# Altium schematic sheet MC_SunSensorPCB.SchDoc
size 594 x 420 mm
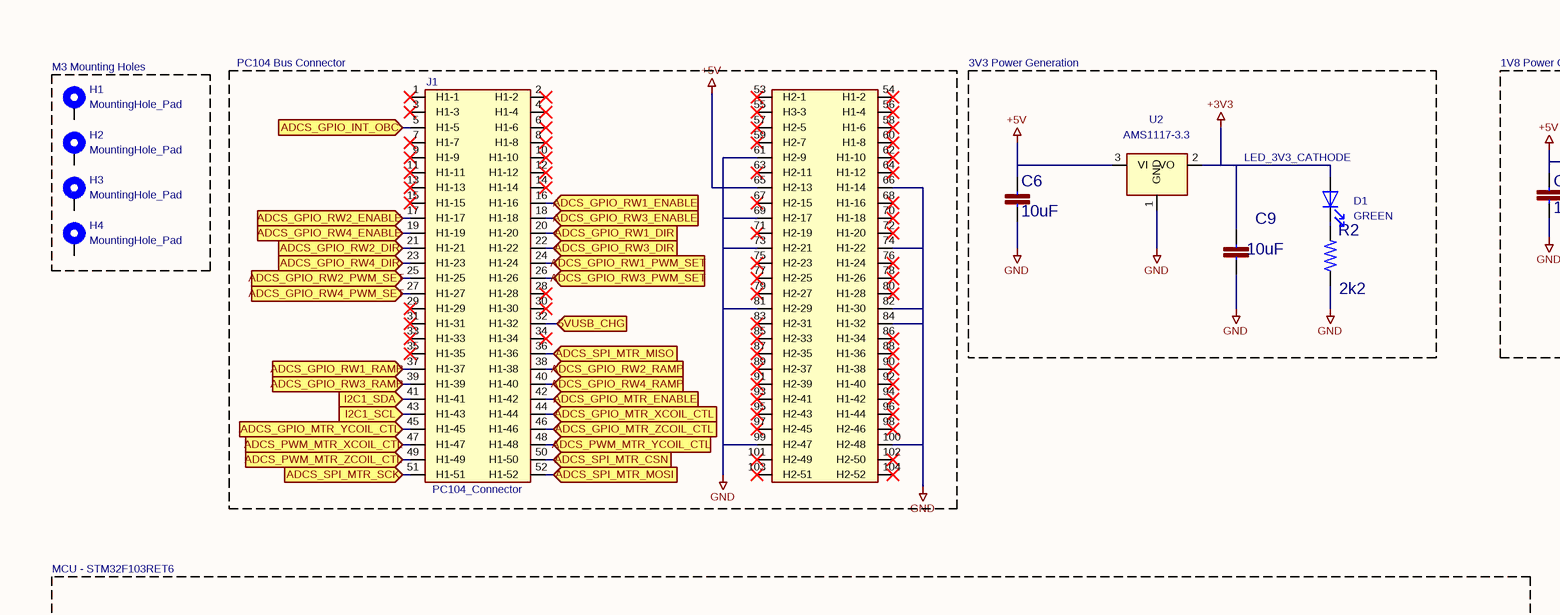
[diagram p0: MC_SunSensorPCB.SchDoc, top left]
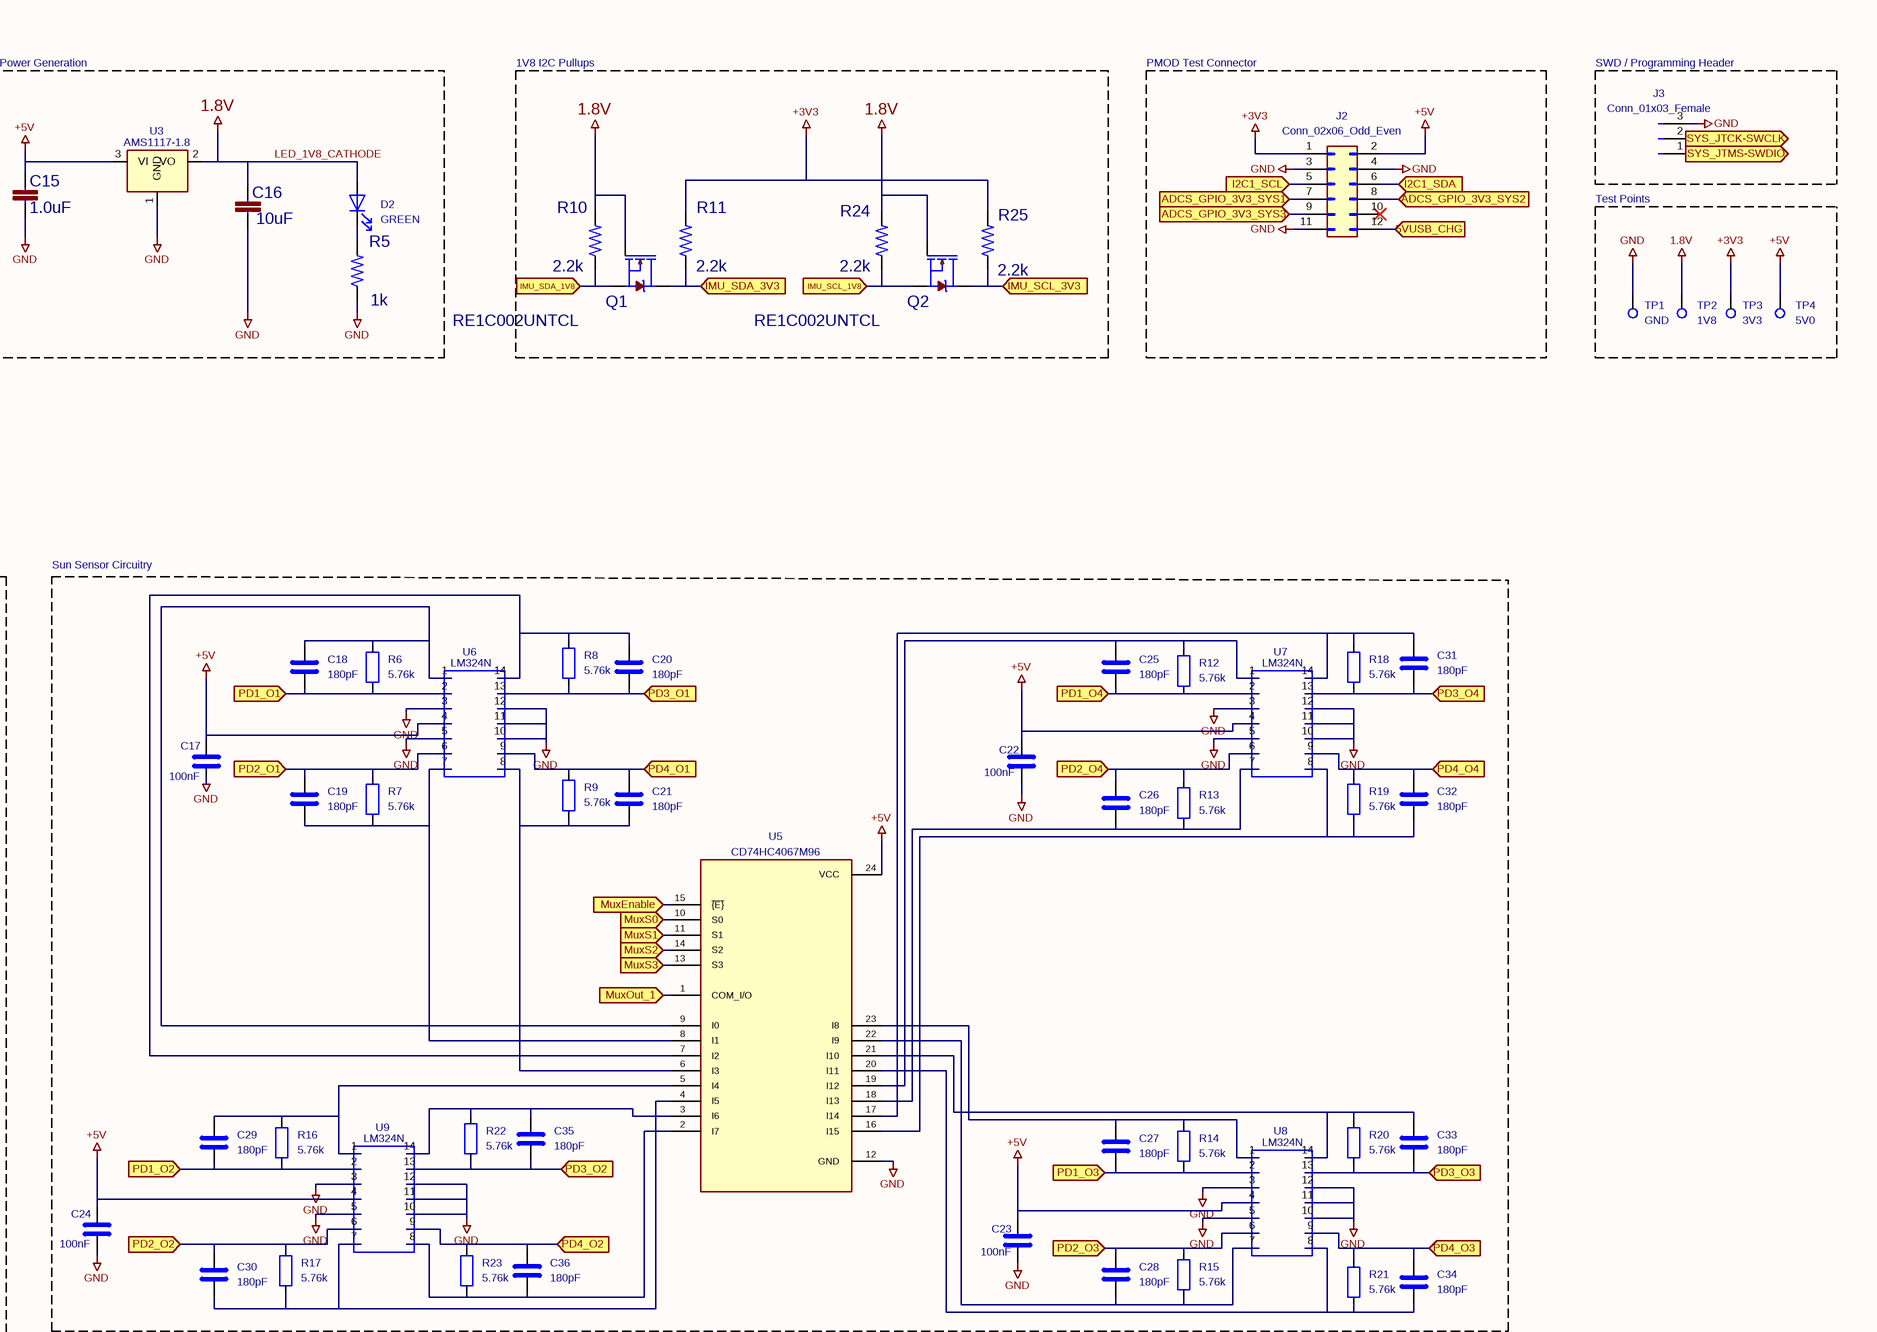
[diagram p1: MC_SunSensorPCB.SchDoc, top right]
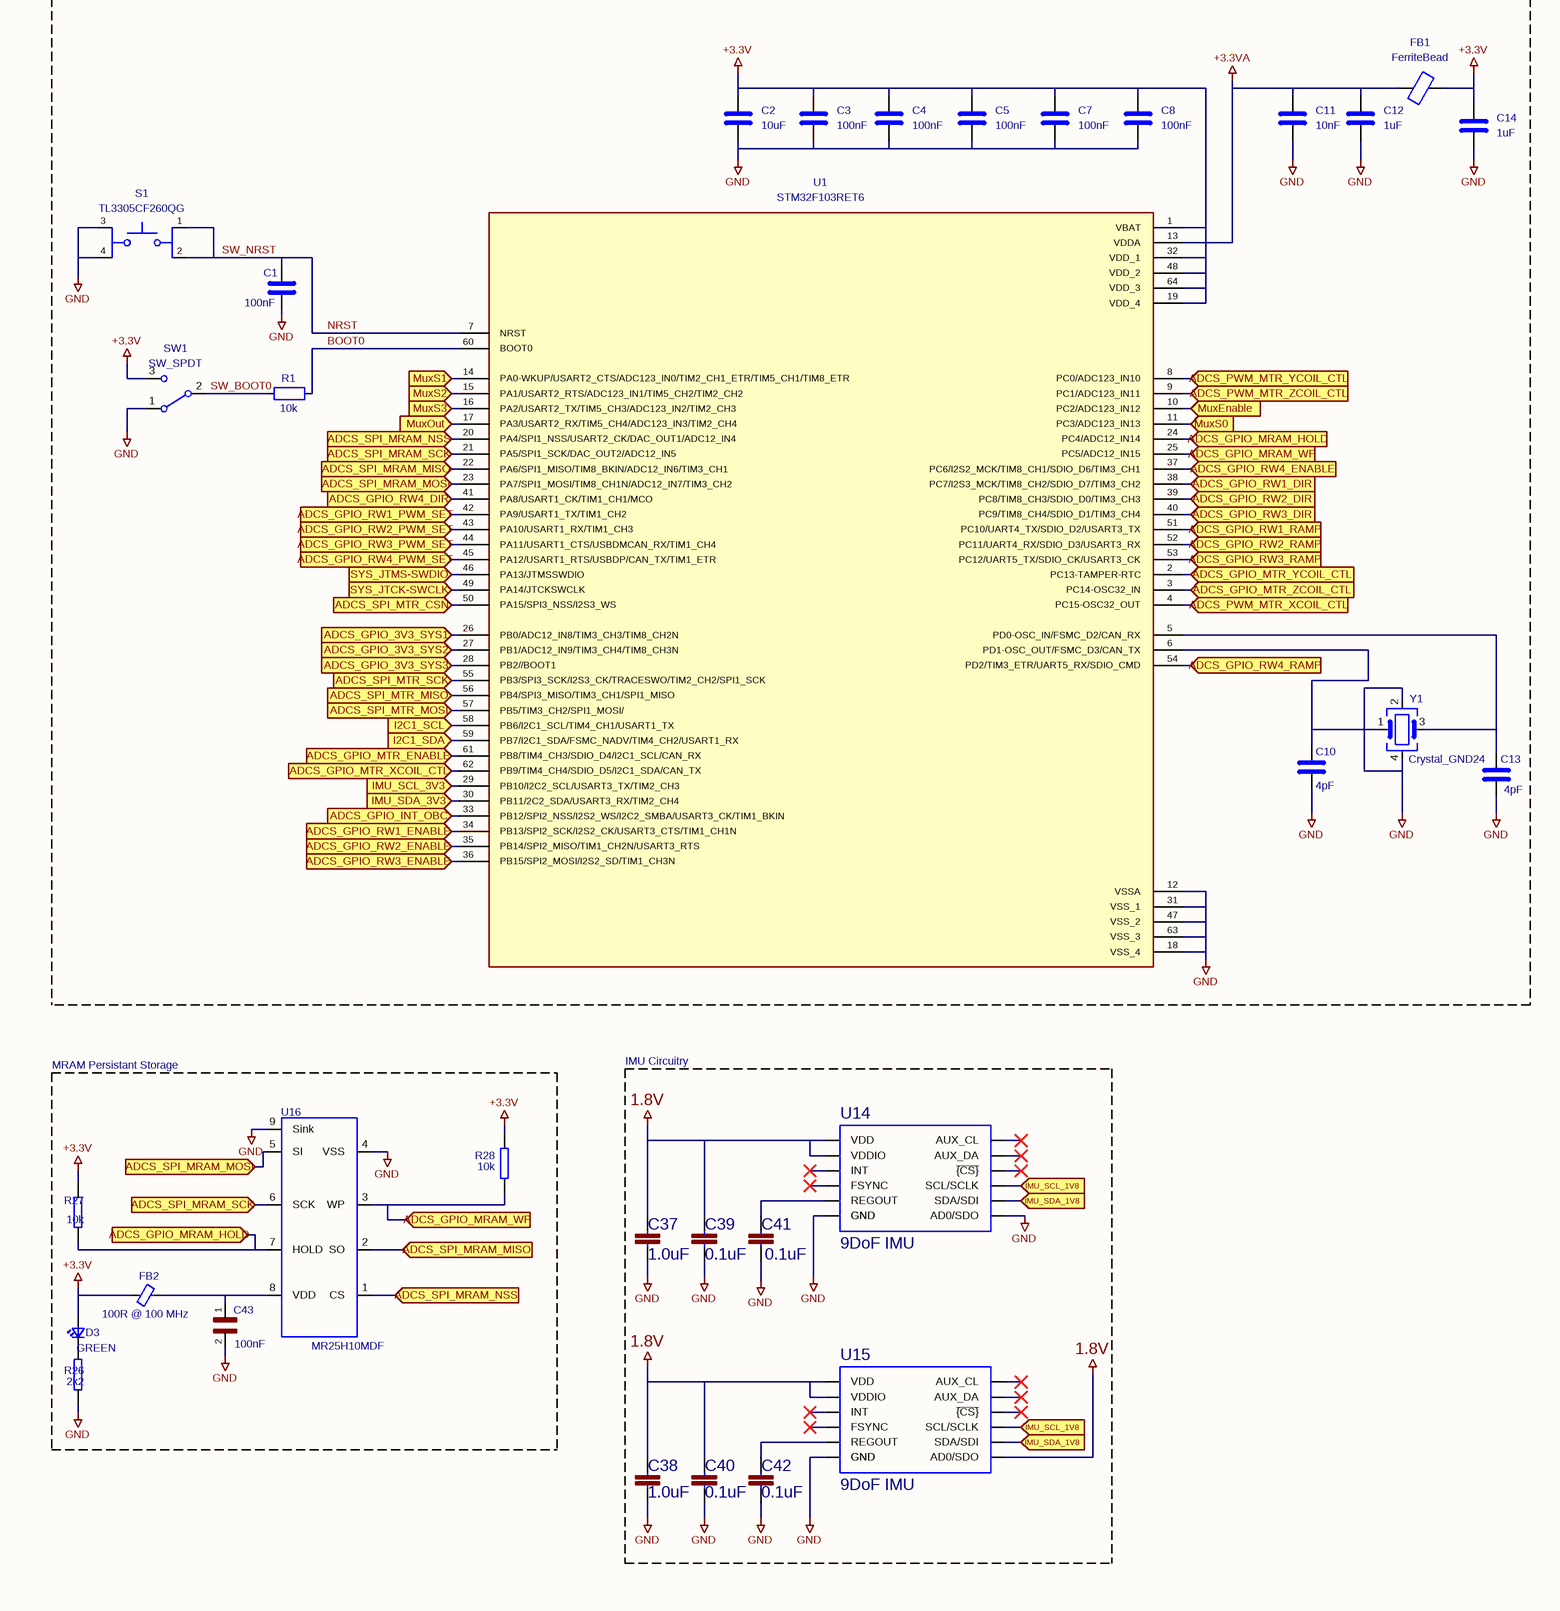
[diagram p2: MC_SunSensorPCB.SchDoc, bottom left]
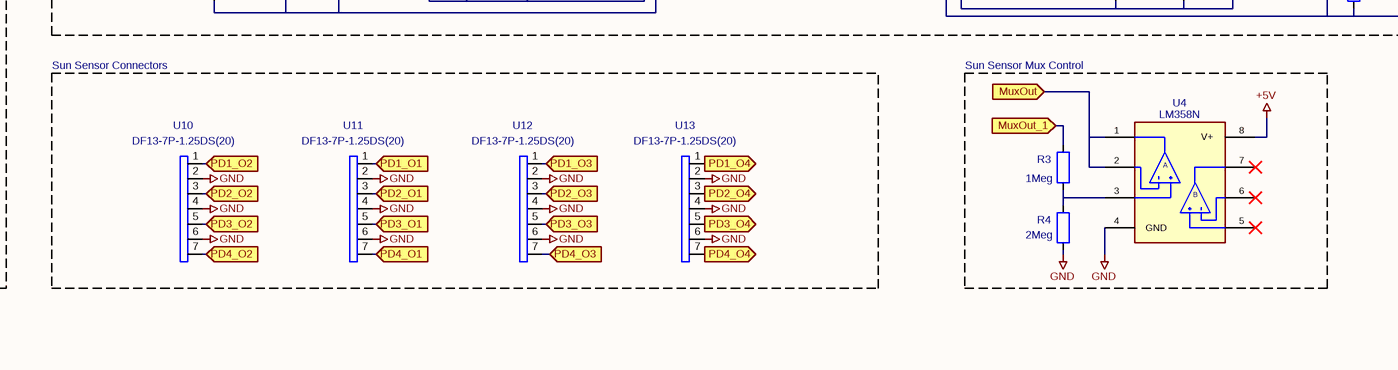
[diagram p3: MC_SunSensorPCB.SchDoc, bottom right]

## Parts
C1  100nF  [C_0603_1608Metric]
C2  10uF  [C_0603_1608Metric]
C3  100nF  [C_0402_1005Metric]
C4  100nF  [C_0402_1005Metric]
C5  100nF  [C_0402_1005Metric]
C6  10uF  [C_0603_1608Metric]
C7  100nF  [C_0402_1005Metric]
C8  100nF  [C_0402_1005Metric]
C9  10uF  [C_0603_1608Metric]
C10  4pF  [C_0402_1005Metric]
C11  10nF  [C_0402_1005Metric]
C12  1uF  [C_0603_1608Metric]
C13  4pF  [C_0402_1005Metric]
C14  1uF  [C_0603_1608Metric]
C15  1.0uF  [C_0603_1608Metric]
C16  10uF  [C_0603_1608Metric]
C17  100nF  [C_0603_1608Metric]
C18  180pF  [C_0603_1608Metric]
C19  180pF  [C_0603_1608Metric]
C20  180pF  [C_0603_1608Metric]
C21  180pF  [C_0603_1608Metric]
C22  100nF  [C_0603_1608Metric]
C23  100nF  [C_0603_1608Metric]
C24  100nF  [C_0603_1608Metric]
C25  180pF  [C_0603_1608Metric]
C26  180pF  [C_0603_1608Metric]
C27  180pF  [C_0603_1608Metric]
C28  180pF  [C_0603_1608Metric]
C29  180pF  [C_0603_1608Metric]
C30  180pF  [C_0603_1608Metric]
C31  180pF  [C_0603_1608Metric]
C32  180pF  [C_0603_1608Metric]
C33  180pF  [C_0603_1608Metric]
C34  180pF  [C_0603_1608Metric]
C35  180pF  [C_0603_1608Metric]
C36  180pF  [C_0603_1608Metric]
C37  1.0uF  [C_0603_1608Metric]
C38  1.0uF  [C_0603_1608Metric]
C39  0.1uF  [C_0603_1608Metric]
C40  0.1uF  [C_0603_1608Metric]
C41  0.1uF  [C_0603_1608Metric]
C42  0.1uF  [C_0603_1608Metric]
C43  100nF  [C_0603_1608Metric]
D1  GREEN  [LED_0603_1608Metric]
D2  GREEN  [LED_0603_1608Metric]
D3  GREEN  [LED_0603_1608Metric]
FB1  FerriteBead  [L_0603_1608Metric]
FB2  100R @ 100 MHz  [L_0603_1608Metric]
H1  MountingHole_Pad  [MountingHole_3.2mm_M3_Pad_TopBottom]
H2  MountingHole_Pad  [MountingHole_3.2mm_M3_Pad_TopBottom]
H3  MountingHole_Pad  [MountingHole_3.2mm_M3_Pad_TopBottom]
H4  MountingHole_Pad  [MountingHole_3.2mm_M3_Pad_TopBottom]
J1  PC104_Connector  [pc104-connector]
J2  Conn_02x06_Odd_Even  [PinSocket_2x06_P2.54mm_Horizontal]
J3  Conn_01x03_Female  [PinHeader_1x03_P2.54mm_Vertical]
Q1  RE1C002UNTCL  [RE1C002UNTCL]
Q2  RE1C002UNTCL  [RE1C002UNTCL]
R1  10k  [R_0603_1608Metric]
R2  2k2  [R_0603_1608Metric]
R3  1Meg  [R_0603_1608Metric]
R4  2Meg  [R_0603_1608Metric]
R5  1k  [R_0603_1608Metric]
R6  5.76k  [R_0603_1608Metric]
R7  5.76k  [R_0603_1608Metric]
R8  5.76k  [R_0603_1608Metric]
R9  5.76k  [R_0603_1608Metric]
R10  2.2k  [R_0603_1608Metric]
R11  2.2k  [R_0603_1608Metric]
R12  5.76k  [R_0603_1608Metric]
R13  5.76k  [R_0603_1608Metric]
R14  5.76k  [R_0603_1608Metric]
R15  5.76k  [R_0603_1608Metric]
R16  5.76k  [R_0603_1608Metric]
R17  5.76k  [R_0603_1608Metric]
R18  5.76k  [R_0603_1608Metric]
R19  5.76k  [R_0603_1608Metric]
R20  5.76k  [R_0603_1608Metric]
R21  5.76k  [R_0603_1608Metric]
R22  5.76k  [R_0603_1608Metric]
R23  5.76k  [R_0603_1608Metric]
R24  2.2k  [R_0603_1608Metric]
R25  2.2k  [R_0603_1608Metric]
R26  2k2  [R_0603_1608Metric]
R27  10k  [R_0402_1005Metric]
R28  10k  [R_0402_1005Metric]
S1  TL3305CF260QG  [SW_TL3305CF260QG]
SW1  SW_SPDT  [SW_SPDT_PCM12]
TP1  GND  [TestPoint_THTPad_2.0x2.0mm_Drill1.0mm]
TP2  1V8  [TestPoint_THTPad_2.0x2.0mm_Drill1.0mm]
TP3  3V3  [TestPoint_THTPad_2.0x2.0mm_Drill1.0mm]
TP4  5V0  [TestPoint_THTPad_2.0x2.0mm_Drill1.0mm]
U1  STM32F103RET6  [QFP50P1200X1200X160-64N]
U2  AMS1117-3.3  [SOT-223-3_TabPin2]
U3  AMS1117-1.8  [SOT-223-3_TabPin2]
U4  LM358N  [DIP794W45P254L959H508Q8]
U5  CD74HC4067M96  [SOIC127P1030X265-24N]
U6  LM324N  [Op-Amp]
U7  LM324N  [Op-Amp]
U8  LM324N  [Op-Amp]
U9  LM324N  [Op-Amp]
U10  DF13-7P-1.25DS(20)  [Hirose_DF13-07P-1.25DS_1x07_P1.25mm_Horizontal]
U11  DF13-7P-1.25DS(20)  [Hirose_DF13-07P-1.25DS_1x07_P1.25mm_Horizontal]
U12  DF13-7P-1.25DS(20)  [Hirose_DF13-07P-1.25DS_1x07_P1.25mm_Horizontal]
U13  DF13-7P-1.25DS(20)  [Hirose_DF13-07P-1.25DS_1x07_P1.25mm_Horizontal]
U14  9DoF IMU  [QFN24-3X3]
U15  9DoF IMU  [QFN24-3X3]
U16  MR25H10MDF  [SON65P300X300X95-8N]
Y1  Crystal_GND24  [Crystal_SMD_3225-4Pin_3.2x2.5mm]

## Blocks framed on the sheet
M3 Mounting Holes /: H1-H4
PC104 Bus Connector: J1
1V8 Power Generation: C15 C16 D2 R5 U3
1V8 I2C Pullups /: Q1 Q2 R10 R11 R24 R25
PMOD Test Connector: J2
SWD / Programming Header: J3
Test Points: TP1-TP4
MCU - STM32F103RET6: C1-C5 C7 C8 C10-C14 FB1 R1 S1 SW1 U1 Y1
Sun Sensor Circuitry: C17-C36 R6-R9 R12-R23 U5-U9
Sun Sensor Connectors: U10-U13
MRAM Persistant Storage: C43 D3 FB2 R26-R28 U16
IMU Circuitry: C37-C42 U14 U15

## Ports
5VUSB_CHG (in), ADCS_GPIO_3V3_SYS1 (in), ADCS_GPIO_3V3_SYS2 (in), ADCS_GPIO_3V3_SYS3 (in), ADCS_GPIO_INT_OBC (in), ADCS_GPIO_MRAM_HOLD (in), ADCS_GPIO_MRAM_WP (in), ADCS_GPIO_MTR_ENABLE (in), ADCS_GPIO_MTR_XCOIL_CTL (in), ADCS_GPIO_MTR_YCOIL_CTL (in), ADCS_GPIO_MTR_ZCOIL_CTL (in), ADCS_GPIO_RW1_DIR (in), ADCS_GPIO_RW1_ENABLE (in), ADCS_GPIO_RW1_PWM_SET (in), ADCS_GPIO_RW1_RAMP (in), ADCS_GPIO_RW2_DIR (in), ADCS_GPIO_RW2_ENABLE (in), ADCS_GPIO_RW2_PWM_SET (in), ADCS_GPIO_RW2_RAMP (in), ADCS_GPIO_RW3_DIR (in), ADCS_GPIO_RW3_ENABLE (in), ADCS_GPIO_RW3_PWM_SET (in), ADCS_GPIO_RW3_RAMP (in), ADCS_GPIO_RW4_DIR (in), ADCS_GPIO_RW4_ENABLE (in), ADCS_GPIO_RW4_PWM_SET (in), ADCS_GPIO_RW4_RAMP (in), ADCS_PWM_MTR_XCOIL_CTL (in), ADCS_PWM_MTR_YCOIL_CTL (in), ADCS_PWM_MTR_ZCOIL_CTL (in), ADCS_SPI_MRAM_MISO (in), ADCS_SPI_MRAM_MOSI (in), ADCS_SPI_MRAM_NSS (in), ADCS_SPI_MRAM_SCK (in), ADCS_SPI_MTR_CSN (in), ADCS_SPI_MTR_MISO (in), ADCS_SPI_MTR_MOSI (in), ADCS_SPI_MTR_SCK (in), I2C1_SCL (in), I2C1_SDA (in), IMU_SCL_1V8 (in), IMU_SCL_3V3 (in), IMU_SDA_1V8 (in), IMU_SDA_3V3 (in), MuxEnable (in), MuxOut (in), MuxOut_1 (in), MuxS0 (in), MuxS1 (in), MuxS2 (in), MuxS3 (in), PD1_O1 (in), PD1_O2 (in), PD1_O3 (in), PD1_O4 (in), PD2_O1 (in), PD2_O2 (in), PD2_O3 (in), PD2_O4 (in), PD3_O1 (in), PD3_O2 (in), PD3_O3 (in), PD3_O4 (in), PD4_O1 (in), PD4_O2 (in), PD4_O3 (in), PD4_O4 (in), SYS_JTCK-SWCLK (in), SYS_JTMS-SWDIO (in)

## Nets
+3.3V: C2.1 C3.1 C4.1 C5.1 C7.1 C8.1 C14.1 D3.2(A) FB1.2 FB2.1 R27.1 R28.2 SW1.3(C) U1.1(VBAT) U1.19(VDD_4) U1.32(VDD_1) U1.48(VDD_2) U1.64(VDD_3)
+3.3VA: C11.1 C12.1 FB1.1 U1.13(VDDA)
+3V3: C9.2 D1.2(A) J2.1(Pin_1) R11.2 R25.2 TP3.1 U2.2(VO)
+5V: C6.1 C15.1 C17.1 C22.1 C23.1 C24.1 J1.65(H2-13) J2.2(Pin_2) TP4.1 U2.3(VI) U3.3(VI) U4.8(V+) U5.24(VCC) U6.4 U7.4 U8.4 U9.4
GND: C1.2 C2.2 C3.2 C4.2 C5.2 C6.2 C7.2 C8.2 C9.1 C10.2 C11.2 C12.2 C13.2 C14.2 C15.2 C16.2 C17.2 C22.2 C23.2 C24.2 C37.2 C38.2 C39.2 C40.2 C41.2 C42.2 C43.2 J1.61(H2-9) J1.66(H1-14) J1.69(H2-17) J1.73(H2-21) J1.74(H1-22) J1.81(H2-29) J1.82(H1-30) J1.84(H1-32) J1.99(H2-47) J1.100(H2-48) J2.3(Pin_3) J2.4(Pin_4) J2.11(Pin_11) J3.3(Pin_3) R2.1 R4.2 R5.1 R26.2 S1.3 S1.4 SW1.1(A) TP1.1 U1.12(VSSA) U1.18(VSS_4) U1.31(VSS_1) U1.47(VSS_2) U1.63(VSS_3) U2.1(GND) U3.1(GND) U4.4(GND) U5.12(GND) U6.3 U6.5 U6.10 U6.11 U6.12 U7.3 U7.5 U7.10 U7.11 U7.12 U8.3 U8.5 U8.10 U8.11 U8.12 U9.3 U9.5 U9.10 U9.11 U9.12 U10.2 U10.4 U10.6 U11.2 U11.4 U11.6 U12.2 U12.4 U12.6 U13.2 U13.4 U13.6 U14.9(AD0/SDO) U14.18(GND) U14.20(GND) U15.18(GND) U15.20(GND) U16.4(VSS) U16.9(Sink) Y1.2 Y1.4
LED_1V8_CATHODE: C16.1 C37.1 C38.1 C39.1 C40.1 D2.2(A) Q1.1(G) Q2.1(G) R10.2 R24.2 TP2.1 U3.2(VO) U14.8(VDDIO) U14.13(VDD) U15.8(VDDIO) U15.9(AD0/SDO) U15.13(VDD)  [also labelled 1.8V]
5VUSB_CHG: J1.32(H1-32) J2.12(Pin_12) ; port 5VUSB_CHG
ADCS_GPIO_3V3_SYS1: J2.7(Pin_7) U1.26(PB0/ADC12_IN8/TIM3_CH3/TIM8_CH2N) ; port ADCS_GPIO_3V3_SYS1
ADCS_GPIO_3V3_SYS2: J2.8(Pin_8) U1.27(PB1/ADC12_IN9/TIM3_CH4/TIM8_CH3N) ; port ADCS_GPIO_3V3_SYS2
ADCS_GPIO_3V3_SYS3: J2.9(Pin_9) U1.28(PB2//BOOT1) ; port ADCS_GPIO_3V3_SYS3
ADCS_GPIO_INT_OBC: J1.5(H1-5) U1.33(PB12/SPI2_NSS/I2S2_WS/I2C2_SMBA/USART3_CK/TIM1_BKIN) ; port ADCS_GPIO_INT_OBC
ADCS_GPIO_MRAM_HOLD: R27.2 U1.24(PC4/ADC12_IN14) U16.7(HOLD) ; port ADCS_GPIO_MRAM_HOLD
ADCS_GPIO_MRAM_WP: R28.1 U1.25(PC5/ADC12_IN15) U16.3(WP) ; port ADCS_GPIO_MRAM_WP
ADCS_GPIO_MTR_ENABLE: J1.42(H1-42) U1.61(PB8/TIM4_CH3/SDIO_D4/I2C1_SCL/CAN_RX) ; port ADCS_GPIO_MTR_ENABLE
ADCS_GPIO_MTR_XCOIL_CTL: J1.44(H1-44) U1.62(PB9/TIM4_CH4/SDIO_D5/I2C1_SDA/CAN_TX) ; port ADCS_GPIO_MTR_XCOIL_CTL
ADCS_GPIO_MTR_YCOIL_CTL: J1.45(H1-45) U1.2(PC13-TAMPER-RTC) ; port ADCS_GPIO_MTR_YCOIL_CTL
ADCS_GPIO_MTR_ZCOIL_CTL: J1.46(H1-46) U1.3(PC14-OSC32_IN) ; port ADCS_GPIO_MTR_ZCOIL_CTL
ADCS_GPIO_RW1_DIR: J1.20(H1-20) U1.38(PC7/I2S3_MCK/TIM8_CH2/SDIO_D7/TIM3_CH2) ; port ADCS_GPIO_RW1_DIR
ADCS_GPIO_RW1_ENABLE: J1.16(H1-16) U1.34(PB13/SPI2_SCK/I2S2_CK/USART3_CTS/TIM1_CH1N) ; port ADCS_GPIO_RW1_ENABLE
ADCS_GPIO_RW1_PWM_SET: J1.24(H1-24) U1.42(PA9/USART1_TX/TIM1_CH2) ; port ADCS_GPIO_RW1_PWM_SET
ADCS_GPIO_RW1_RAMP: J1.37(H1-37) U1.51(PC10/UART4_TX/SDIO_D2/USART3_TX) ; port ADCS_GPIO_RW1_RAMP
ADCS_GPIO_RW2_DIR: J1.21(H1-21) U1.39(PC8/TIM8_CH3/SDIO_D0/TIM3_CH3) ; port ADCS_GPIO_RW2_DIR
ADCS_GPIO_RW2_ENABLE: J1.17(H1-17) U1.35(PB14/SPI2_MISO/TIM1_CH2N/USART3_RTS) ; port ADCS_GPIO_RW2_ENABLE
ADCS_GPIO_RW2_PWM_SET: J1.25(H1-25) U1.43(PA10/USART1_RX/TIM1_CH3) ; port ADCS_GPIO_RW2_PWM_SET
ADCS_GPIO_RW2_RAMP: J1.38(H1-38) U1.52(PC11/UART4_RX/SDIO_D3/USART3_RX) ; port ADCS_GPIO_RW2_RAMP
ADCS_GPIO_RW3_DIR: J1.22(H1-22) U1.40(PC9/TIM8_CH4/SDIO_D1/TIM3_CH4) ; port ADCS_GPIO_RW3_DIR
ADCS_GPIO_RW3_ENABLE: J1.18(H1-18) U1.36(PB15/SPI2_MOSI/I2S2_SD/TIM1_CH3N) ; port ADCS_GPIO_RW3_ENABLE
ADCS_GPIO_RW3_PWM_SET: J1.26(H1-26) U1.44(PA11/USART1_CTS/USBDMCAN_RX/TIM1_CH4) ; port ADCS_GPIO_RW3_PWM_SET
ADCS_GPIO_RW3_RAMP: J1.39(H1-39) U1.53(PC12/UART5_TX/SDIO_CK/USART3_CK) ; port ADCS_GPIO_RW3_RAMP
ADCS_GPIO_RW4_DIR: J1.23(H1-23) U1.41(PA8/USART1_CK/TIM1_CH1/MCO) ; port ADCS_GPIO_RW4_DIR
ADCS_GPIO_RW4_ENABLE: J1.19(H1-19) U1.37(PC6/I2S2_MCK/TIM8_CH1/SDIO_D6/TIM3_CH1) ; port ADCS_GPIO_RW4_ENABLE
ADCS_GPIO_RW4_PWM_SET: J1.27(H1-27) U1.45(PA12/USART1_RTS/USBDP/CAN_TX/TIM1_ETR) ; port ADCS_GPIO_RW4_PWM_SET
ADCS_GPIO_RW4_RAMP: J1.40(H1-40) U1.54(PD2/TIM3_ETR/UART5_RX/SDIO_CMD) ; port ADCS_GPIO_RW4_RAMP
ADCS_PWM_MTR_XCOIL_CTL: J1.47(H1-47) U1.4(PC15-OSC32_OUT) ; port ADCS_PWM_MTR_XCOIL_CTL
ADCS_PWM_MTR_YCOIL_CTL: J1.48(H1-48) U1.8(PC0/ADC123_IN10) ; port ADCS_PWM_MTR_YCOIL_CTL
ADCS_PWM_MTR_ZCOIL_CTL: J1.49(H1-49) U1.9(PC1/ADC123_IN11) ; port ADCS_PWM_MTR_ZCOIL_CTL
ADCS_SPI_MRAM_MISO: U1.22(PA6/SPI1_MISO/TIM8_BKIN/ADC12_IN6/TIM3_CH1) U16.2(SO) ; port ADCS_SPI_MRAM_MISO
ADCS_SPI_MRAM_MOSI: U1.23(PA7/SPI1_MOSI/TIM8_CH1N/ADC12_IN7/TIM3_CH2) U16.5(SI) ; port ADCS_SPI_MRAM_MOSI
ADCS_SPI_MRAM_NSS: U1.20(PA4/SPI1_NSS/USART2_CK/DAC_OUT1/ADC12_IN4) U16.1(CS) ; port ADCS_SPI_MRAM_NSS
ADCS_SPI_MRAM_SCK: U1.21(PA5/SPI1_SCK/DAC_OUT2/ADC12_IN5) U16.6(SCK) ; port ADCS_SPI_MRAM_SCK
ADCS_SPI_MTR_CSN: J1.50(H1-50) U1.50(PA15/SPI3_NSS/I2S3_WS) ; port ADCS_SPI_MTR_CSN
ADCS_SPI_MTR_MISO: J1.36(H1-36) U1.56(PB4/SPI3_MISO/TIM3_CH1/SPI1_MISO) ; port ADCS_SPI_MTR_MISO
ADCS_SPI_MTR_MOSI: J1.52(H1-52) U1.57(PB5/TIM3_CH2/SPI1_MOSI/) ; port ADCS_SPI_MTR_MOSI
ADCS_SPI_MTR_SCK: J1.51(H1-51) U1.55(PB3/SPI3_SCK/I2S3_CK/TRACESWO/TIM2_CH2/SPI1_SCK) ; port ADCS_SPI_MTR_SCK
BOOT0: R1.2 U1.60(BOOT0)
I2C1_SCL: J1.43(H1-43) J2.5(Pin_5) U1.58(PB6/I2C1_SCL/TIM4_CH1/USART1_TX) ; port I2C1_SCL
I2C1_SDA: J1.41(H1-41) J2.6(Pin_6) U1.59(PB7/I2C1_SDA/FSMC_NADV/TIM4_CH2/USART1_RX) ; port I2C1_SDA
IMU_SCL_1V8: Q2.2(S) R24.1 U14.23(SCL/SCLK) U15.23(SCL/SCLK) ; port IMU_SCL_1V8
IMU_SCL_3V3: Q2.3(D) R25.1 U1.29(PB10/I2C2_SCL/USART3_TX/TIM2_CH3) ; port IMU_SCL_3V3
IMU_SDA_1V8: Q1.2(S) R10.1 U14.24(SDA/SDI) U15.24(SDA/SDI) ; port IMU_SDA_1V8
IMU_SDA_3V3: Q1.3(D) R11.1 U1.30(PB11/2C2_SDA/USART3_RX/TIM2_CH4) ; port IMU_SDA_3V3
MuxEnable: U1.10(PC2/ADC123_IN12) U5.15(~{{E}}) ; port MuxEnable
MuxOut: U1.17(PA3/USART2_RX/TIM5_CH4/ADC123_IN3/TIM2_CH4) U4.1 U4.2 ; port MuxOut
MuxOut_1: R3.1 U5.1(COM_I/O) ; port MuxOut_1
MuxS0: U1.11(PC3/ADC123_IN13) U5.10(S0) ; port MuxS0
MuxS1: U1.14(PA0-WKUP/USART2_CTS/ADC123_IN0/TIM2_CH1_ETR/TIM5_CH1/TIM8_ETR) U5.11(S1) ; port MuxS1
MuxS2: U1.15(PA1/USART2_RTS/ADC123_IN1/TIM5_CH2/TIM2_CH2) U5.14(S2) ; port MuxS2
MuxS3: U1.16(PA2/USART2_TX/TIM5_CH3/ADC123_IN2/TIM2_CH3) U5.13(S3) ; port MuxS3
NRST: C1.1 S1.1 S1.2 U1.7(NRST)  [also labelled SW_NRST]
PD1_O1: C18.2 R6.2 U6.2 U11.1 ; port PD1_O1
PD1_O2: C29.2 R16.2 U9.2 U10.1 ; port PD1_O2
PD1_O3: C27.2 R14.2 U8.2 U12.1 ; port PD1_O3
PD1_O4: C25.2 R12.2 U7.2 U13.1 ; port PD1_O4
PD2_O1: C19.2 R7.1 U6.6 U11.3 ; port PD2_O1
PD2_O2: C30.2 R17.1 U9.6 U10.3 ; port PD2_O2
PD2_O3: C28.2 R15.1 U8.6 U12.3 ; port PD2_O3
PD2_O4: C26.2 R13.1 U7.6 U13.3 ; port PD2_O4
PD3_O1: C20.2 R8.2 U6.13 U11.5 ; port PD3_O1
PD3_O2: C35.2 R22.2 U9.13 U10.5 ; port PD3_O2
PD3_O3: C33.2 R20.2 U8.13 U12.5 ; port PD3_O3
PD3_O4: C31.2 R18.2 U7.13 U13.5 ; port PD3_O4
PD4_O1: C21.1 R9.1 U6.9 U11.7 ; port PD4_O1
PD4_O2: C36.1 R23.1 U9.9 U10.7 ; port PD4_O2
PD4_O3: C34.1 R21.1 U8.9 U12.7 ; port PD4_O3
PD4_O4: C32.1 R19.1 U7.9 U13.7 ; port PD4_O4
SW_BOOT0: R1.1 SW1.2(B)
SYS_JTCK-SWCLK: J3.2(Pin_2) U1.49(PA14/JTCKSWCLK) ; port SYS_JTCK-SWCLK
SYS_JTMS-SWDIO: J3.1(Pin_1) U1.46(PA13/JTMSSWDIO) ; port SYS_JTMS-SWDIO
NetC10_1: C10.1 U1.6(PD1-OSC_OUT/FSMC_D3/CAN_TX) Y1.1
NetC13_1: C13.1 U1.5(PD0-OSC_IN/FSMC_D2/CAN_RX) Y1.3
NetC18_1: C18.1 R6.1 U5.9(I0) U6.1
NetC19_1: C19.1 R7.2 U5.8(I1) U6.7
NetC20_1: C20.1 R8.1 U5.7(I2) U6.14
NetC21_2: C21.2 R9.2 U5.6(I3) U6.8
NetC25_1: C25.1 R12.1 U5.19(I12) U7.1
NetC26_1: C26.1 R13.2 U5.18(I13) U7.7
NetC27_1: C27.1 R14.1 U5.23(I8) U8.1
NetC28_1: C28.1 R15.2 U5.22(I9) U8.7
NetC29_1: C29.1 R16.1 U5.5(I4) U9.1
NetC30_1: C30.1 R17.2 U5.4(I5) U9.7
NetC31_1: C31.1 R18.1 U5.17(I14) U7.14
NetC32_2: C32.2 R19.2 U5.16(I15) U7.8
NetC33_1: C33.1 R20.1 U5.21(I10) U8.14
NetC34_2: C34.2 R21.2 U5.20(I11) U8.8
NetC35_1: C35.1 R22.1 U5.3(I6) U9.14
NetC36_2: C36.2 R23.2 U5.2(I7) U9.8
NetC41_1: C41.1 U14.10(REGOUT)
NetC42_1: C42.1 U15.10(REGOUT)
NetC43_1: C43.1 FB2.2 U16.8(VDD)
NetD1_1: D1.1(K) R2.2
NetD2_1: D2.1(K) R5.2
NetD3_1: D3.1(K) R26.1
NetR3_2: R3.2 R4.1 U4.3

Not connected (* = marked no-connect by the designer): H1 1; H2 1; H3 1; H4 1; J1 1(H1-1)* 2(H1-2)* 3(H1-3)* 4(H1-4)* 6(H1-6)* 7(H1-7)* 8(H1-8)* 9(H1-9)* 10(H1-10)* 11(H1-11)* 12(H1-12)* 13(H1-13)* 14(H1-14)* 15(H1-15)* 28(H1-28)* 29(H1-29)* 30(H1-30)* 31(H1-31)* 33(H1-33)* 34(H1-34)* 35(H1-35)* 53(H2-1)* 54(H1-2)* 55(H3-3)* 56(H1-4)* 57(H2-5)* 58(H1-6)* 59(H2-7)* 60(H1-8)* 62(H1-10)* 63(H2-11)* 64(H1-12)* 67(H2-15)* 68(H1-16)* 70(H1-18)* 71(H2-19)* 72(H1-20)* 75(H2-23)* 76(H1-24)* 77(H2-25)* 78(H1-26)* 79(H2-27)* 80(H1-28)* 83(H2-31)* 85(H2-33)* 86(H1-34)* 87(H2-35)* 88(H1-36)* 89(H2-37)* 90(H1-38)* 91(H2-39)* 92(H1-40)* 93(H2-41)* 94(H1-42)* 95(H2-43)* 96(H1-44)* 97(H2-45)* 98(H2-46)* 101(H2-49)* 102(H2-50)* 103(H2-51)* 104(H2-52)*; J2 10(Pin_10)*; U4 5* 6* 7*; U14 7(AUX_CL)* 11(FSYNC)* 12(INT)* 21(AUX_DA)* 22(~{{CS}})*; U15 7(AUX_CL)* 11(FSYNC)* 12(INT)* 21(AUX_DA)* 22(~{{CS}})*

## Notes on the sheet
- 3V3 Power Generation
- (near D1) LED_3V3_CATHODE
- Sun Sensor Mux Control
- 1
- 2
- 3
- 4
- 5
- 6
- 7
- 8
- 9
- 10
- 11
- A
- B
- C
- D
- E
- F
- G
- H
- Title:
- File: MC_SunSensorPCB.kicad_sch
- Sheet: /
- KiCad E.D.A.  kicad (5.1.4)-1
- Size: A2
- Date:
- Rev:
- Id: 1/1
- (in symbol LM358) A; B

## Library data of the parts
C1-C5 C7 C8 C10-C14 C17-C36 = C
  C1 C17 C22-C24: Value: 100nF; Footprint: Capacitor_SMD:C_0603_1608Metric
  C2: Value: 10uF; Footprint: Capacitor_SMD:C_0603_1608Metric
  C3-C5 C7 C8: Value: 100nF; Footprint: Capacitor_SMD:C_0402_1005Metric
  C10 C13: Value: 4pF; Footprint: Capacitor_SMD:C_0402_1005Metric
  C11: Value: 10nF; Footprint: Capacitor_SMD:C_0402_1005Metric
  C12 C14: Value: 1uF; Footprint: Capacitor_SMD:C_0603_1608Metric
  C18-C21 C25-C36: Value: 180pF; Footprint: Capacitor_SMD:C_0603_1608Metric
C6 C9 C15 C16 C37 C38 = 1.0UF-0603-16V-10%-X7R: Footprint: Capacitor_SMD:C_0603_1608Metric
  C6 C9 C16: Value: 10uF
  C15 C37 C38: Value: 1.0uF
C39-C42 = 0.1UF-0603-25V-5%: Value: 0.1uF; Footprint: Capacitor_SMD:C_0603_1608Metric
C43 = CC0603MRX5R5BB475-CC0603MRX5R5BB475: Value: 100nF; Footprint: Capacitor_SMD:C_0603_1608Metric
D1 D2 = LED: Value: GREEN; Footprint: LED_SMD:LED_0603_1608Metric
D3 = LED_Small: Value: GREEN; Footprint: LED_SMD:LED_0603_1608Metric
FB2 = Ferrite_Bead_Small: Value: 100R @ 100 MHz; Footprint: Inductor_SMD:L_0603_1608Metric
Q1 Q2 = MOSFET-NCH-RE1C002UN: Value: RE1C002UNTCL; Footprint: qset-footprints:RE1C002UNTCL
R1 R3 R4 R6-R9 R12-R23 = R: Footprint: Resistor_SMD:R_0603_1608Metric
  R1: Value: 10k
  R3: Value: 1Meg
  R4: Value: 2Meg
  R6-R9 R12-R23: Value: 5.76k
R2 R5 = 220OHM-0603-1{slash}10W-1%: Footprint: Resistor_SMD:R_0603_1608Metric
  R2: Value: 2k2
  R5: Value: 1k
R10 R11 R24 R25 = 2.2KOHM-0402T-1{slash}16W-1%: Value: 2.2k; Footprint: Resistor_SMD:R_0603_1608Metric
R26-R28 = R0603-OBC_Libary
  R26: Value: 2k2; Footprint: Resistor_SMD:R_0603_1608Metric
  R27 R28: Value: 10k; Footprint: Resistor_SMD:R_0402_1005Metric
S1 = TL3305CF260QG: MANUFACTURER: E-Switch; SNAPEDA_PN: TL3305BF260QG; MAXIMUM_PACKAGE_HEIGHT: 5 mm; STANDARD: Manufacturer Recommendations; PARTREV: C; Value: TL3305CF260QG; Footprint: qset-footprints:SW_TL3305CF260QG
TP1-TP4 = TestPoint: Footprint: TestPoint:TestPoint_THTPad_2.0x2.0mm_Drill1.0mm
  TP1: Value: GND
  TP2: Value: 1V8
  TP3: Value: 3V3
  TP4: Value: 5V0
U1 = STM32F103RET6: MANUFACTURER: STMicroelectronics; STANDARD: IPC-7351B; Value: STM32F103RET6; Footprint: qset-footprints:QFP50P1200X1200X160-64N
U4 = LM358: Value: LM358N; Footprint: qset-footprints:DIP794W45P254L959H508Q8
U6-U9 = Op-Amp: Value: LM324N; Footprint: qset-footprints:Op-Amp
U10-U13 = DF13-4P-1.25DS(20): Value: DF13-7P-1.25DS(20); Footprint: Connector_Hirose:Hirose_DF13-07P-1.25DS_1x07_P1.25mm_Horizontal
U14 U15 = ICM-20948: Value: 9DoF IMU; Footprint: qset-footprints:QFN24-3X3
U16 = MR25H10MDF-MRAM_Symbol: Value: MR25H10MDF; Footprint: qset-footprints:SON65P300X300X95-8N
FB1 = FerriteBead: Value: FerriteBead; Footprint: Inductor_SMD:L_0603_1608Metric
H1-H4 = MountingHole_Pad: Value: MountingHole_Pad; Footprint: MountingHole:MountingHole_3.2mm_M3_Pad_TopBottom
J1 = PC104_Connector: Value: PC104_Connector; Footprint: qset-footprints:pc104-connector
J2 = Conn_02x06_Odd_Even: Value: Conn_02x06_Odd_Even; Footprint: Connector_PinSocket_2.54mm:PinSocket_2x06_P2.54mm_Horizontal
J3 = Conn_01x03_Female: Value: Conn_01x03_Female; Footprint: Connector_PinHeader_2.54mm:PinHeader_1x03_P2.54mm_Vertical
SW1 = SW_SPDT: Value: SW_SPDT; Footprint: Button_Switch_SMD:SW_SPDT_PCM12
U2 = AMS1117-3.3: Value: AMS1117-3.3; Footprint: Package_TO_SOT_SMD:SOT-223-3_TabPin2
U3 = AMS1117-1.8: Value: AMS1117-1.8; Footprint: Package_TO_SOT_SMD:SOT-223-3_TabPin2
U5 = CD74HC4067M96: Value: CD74HC4067M96; Footprint: qset-footprints:SOIC127P1030X265-24N
Y1 = Crystal_GND24: Value: Crystal_GND24; Footprint: Crystal:Crystal_SMD_3225-4Pin_3.2x2.5mm